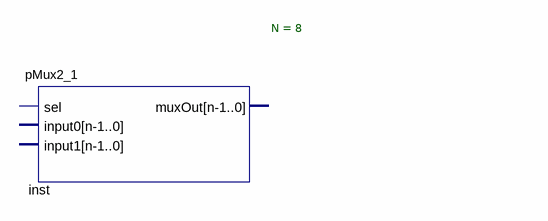
[diagram p0: schematic sheet]
// Quartus schematic ProcessadorCompleto.bdf as structural Verilog: 1 symbols, 0 pins
module ProcessadorCompleto (
);

  pMux2_1 #(.N(8)) inst ();  // open: sel, input0, input1, muxOut
endmodule
